# Altium schematic sheet switchPanel.SchDoc
size A4
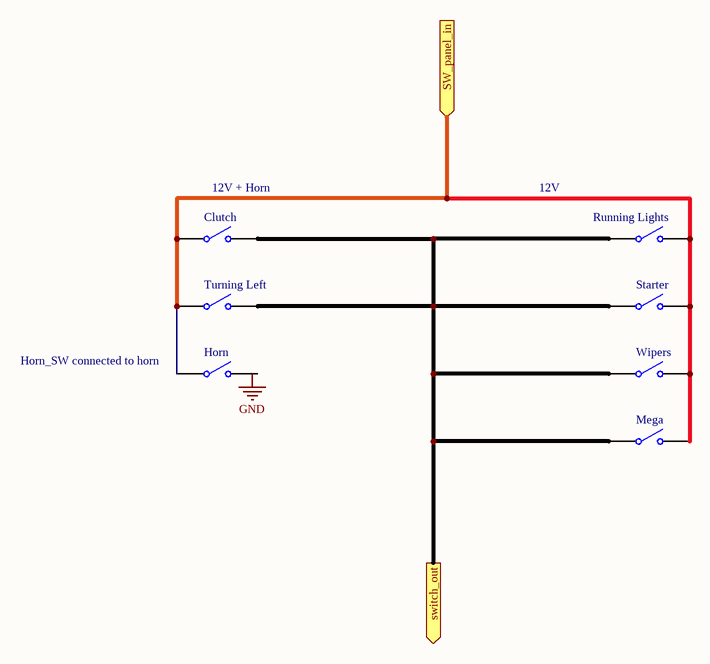
[diagram p0: switchPanel.SchDoc]

## Parts
Clutch  SW-SPST  [SPST-2]  (value not drawn)
Horn  SW-SPST  [SPST-2]  (value not drawn)
Mega  SW-SPST  [SPST-2]  (value not drawn)
Running_Lights  SW-SPST  [SPST-2]  (value not drawn)
Starter  SW-SPST  [SPST-2]  (value not drawn)
Turning_Left  SW-SPST  [SPST-2]  (value not drawn)
Wipers  SW-SPST  [SPST-2]  (value not drawn)

## Ports
SW_panel_in (in), switch_out (out)

## Nets
SW_panel_in: Clutch.1(COMMON) Horn.1(COMMON) Mega.2(NO) Running_Lights.2(NO) Starter.2(NO) Turning_Left.1(COMMON) Wipers.2(NO) ; port SW_panel_in
switch_out: Clutch.2(NO) Mega.1(COMMON) Running_Lights.1(COMMON) Starter.1(COMMON) Turning_Left.2(NO) Wipers.1(COMMON) ; port switch_out

Not connected (* = marked no-connect by the designer): Horn 2(NO)

## Notes on the sheet
- (near Clutch) 12V + Horn
- 12V
- (near Horn) Horn_SW connected to horn
- Labels drawn without touching a wire or pin: GND

## Library data of the parts
Clutch Horn Mega Running_Lights Starter Turning_Left Wipers = SW-SPST: Single-Pole, Single-Throw Switch; Published: 24-Mar-1999; LatestRevisionDate: 17-Jul-2002; LatestRevisionNote: Re-released for DXP Platform.; PackageReference: SPST-2; Publisher: Altium Limited; PackageDescription: Switch; 2 Leads